# Altium schematic sheet eVV_Power Supply Block Diagram.SchDoc: eVV_Power Supply Block Diagram
size A4; DrawnBy: Ivica Matovic; Revision: 1.1; SheetNumber: 2; SheetTotal: 8
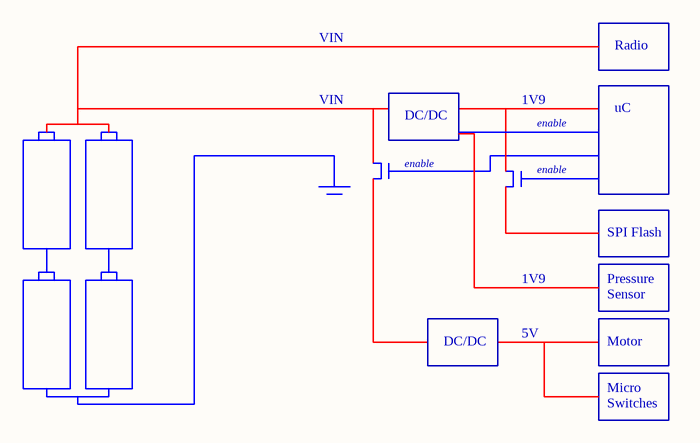
[diagram p0: eVV_Power Supply Block Diagram.SchDoc]

## Notes on the sheet
- VIN
- Radio
- DC/DC
- 1V9
- enable
- uC
- SPI Flash
- Pressure
- Sensor
- 5V
- Motor
- Micro
- Switches
- Title:
- Bitgear
- Size:
- Date:
- Drawn By:
- A
- Doc. No:
- Time:
- Checked By:
- Sheet
- Rev:
- of
- Stevana Markovica 8
- 11080 Belgrade
- Serbia
- www.bitgear.rs
- Approved By:
- File: